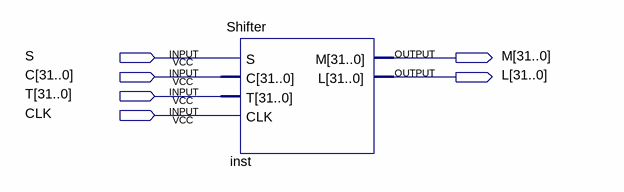
[diagram p0: schematic sheet]
// Quartus schematic testmux.bdf as structural Verilog: 1 symbols, 6 pins
module testmux (
  input  S,
  input  [31:0] C,
  input  [31:0] T,
  input  CLK,
  output [31:0] M,
  output [31:0] L
);

  Shifter inst (.S(S), .C(C), .T(T), .CLK(CLK), .M(M), .L(L));
endmodule
